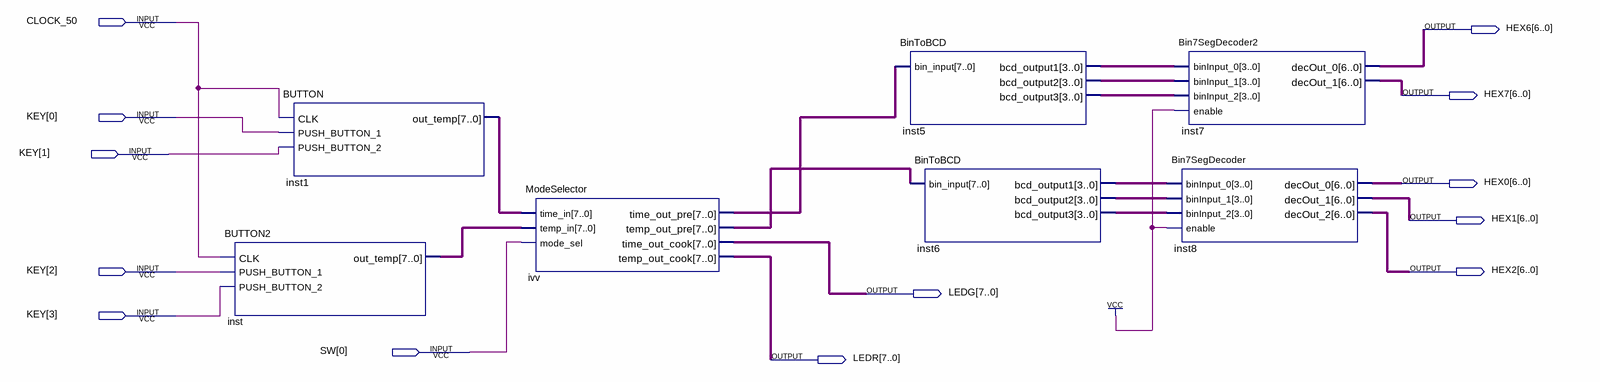
[diagram p0: schematic sheet]
// Quartus schematic User.bdf as structural Verilog: 7 symbols, 13 pins
module User (
  input  CLOCK_50,
  input  [3:0] KEY,
  input  [0:0] SW,
  output [6:0] HEX6,
  output [6:0] HEX7,
  output [6:0] HEX0,
  output [6:0] HEX1,
  output [6:0] HEX2,
  output [7:0] LEDG,
  output [7:0] LEDR
);

  wire [3:0] inst5_bcd_output1, inst5_bcd_output2, inst5_bcd_output3, inst6_bcd_output1, inst6_bcd_output2,
       inst6_bcd_output3;
  wire [7:0] inst1_out_temp, inst_out_temp, ivv_temp_out_pre, ivv_time_out_pre;

  BUTTON2 inst (.CLK(CLOCK_50), .PUSH_BUTTON_1(KEY[2]), .PUSH_BUTTON_2(KEY[3]), .out_temp(inst_out_temp));
  BUTTON inst1 (.CLK(CLOCK_50), .PUSH_BUTTON_1(KEY[0]), .PUSH_BUTTON_2(KEY[1]), .out_temp(inst1_out_temp));
  ModeSelector ivv (
    .time_in(inst1_out_temp), .temp_in(inst_out_temp), .mode_sel(SW[0]), .time_out_pre(ivv_time_out_pre),
    .temp_out_pre(ivv_temp_out_pre), .time_out_cook(LEDG), .temp_out_cook(LEDR));
  BinToBCD inst5 (
    .bin_input(ivv_time_out_pre), .bcd_output1(inst5_bcd_output1), .bcd_output2(inst5_bcd_output2),
    .bcd_output3(inst5_bcd_output3));
  BinToBCD inst6 (
    .bin_input(ivv_temp_out_pre), .bcd_output1(inst6_bcd_output1), .bcd_output2(inst6_bcd_output2),
    .bcd_output3(inst6_bcd_output3));
  Bin7SegDecoder2 inst7 (
    .binInput_0(inst5_bcd_output1), .binInput_1(inst5_bcd_output2), .binInput_2(inst5_bcd_output3),
    .enable(1'b1), .decOut_0(HEX6), .decOut_1(HEX7));
  Bin7SegDecoder inst8 (
    .binInput_0(inst6_bcd_output1), .binInput_1(inst6_bcd_output2), .binInput_2(inst6_bcd_output3),
    .enable(1'b1), .decOut_0(HEX0), .decOut_1(HEX1), .decOut_2(HEX2));
endmodule
